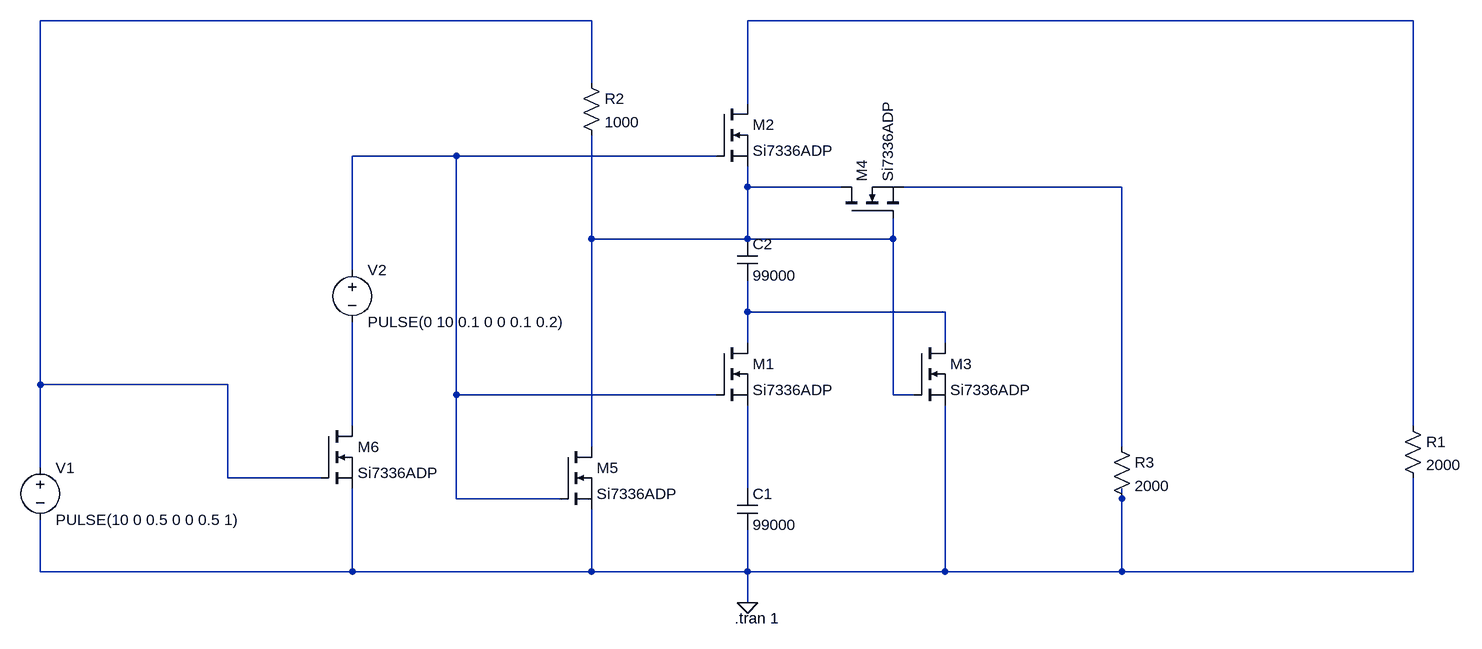
[diagram p0: schematic battery_cell_configuration_change.asc]
battery_cell_configuration_change.asc, the LTspice schematic file:
Version 4
SHEET 1 1140 680
WIRE -208 -576 -1056 -576
WIRE 1056 -576 32 -576
WIRE -208 -480 -208 -576
WIRE 32 -448 32 -576
WIRE -416 -368 -576 -368
WIRE -16 -368 -416 -368
WIRE 32 -320 32 -352
WIRE 176 -320 32 -320
WIRE 608 -320 272 -320
WIRE -208 -240 -208 -400
WIRE 32 -240 32 -320
WIRE 32 -240 -208 -240
WIRE 256 -240 256 -272
WIRE 256 -240 32 -240
WIRE -576 -192 -576 -368
WIRE 32 -128 32 -176
WIRE 336 -128 32 -128
WIRE 32 -80 32 -128
WIRE 336 -80 336 -128
WIRE -1056 -16 -1056 -576
WIRE -768 -16 -1056 -16
WIRE -416 0 -416 -368
WIRE -16 0 -416 0
WIRE 256 0 256 -240
WIRE 288 0 256 0
WIRE -576 48 -576 -112
WIRE 1056 48 1056 -576
WIRE -208 80 -208 -240
WIRE 608 80 608 -320
WIRE -1056 112 -1056 -16
WIRE -768 128 -768 -16
WIRE -624 128 -768 128
WIRE 32 144 32 16
WIRE -416 160 -416 0
WIRE -256 160 -416 160
WIRE 608 160 608 144
WIRE -1056 272 -1056 192
WIRE -576 272 -576 144
WIRE -576 272 -1056 272
WIRE -208 272 -208 176
WIRE -208 272 -576 272
WIRE 32 272 32 208
WIRE 32 272 -208 272
WIRE 336 272 336 16
WIRE 336 272 32 272
WIRE 608 272 608 160
WIRE 608 272 336 272
WIRE 1056 272 1056 128
WIRE 1056 272 608 272
WIRE 32 320 32 272
FLAG 32 320 0
SYMBOL cap 16 144 R0
SYMATTR InstName C1
SYMATTR Value 99000
SYMATTR SpiceLine Rser=100m,IC=2
SYMBOL cap 16 -240 R0
SYMATTR InstName C2
SYMATTR Value 99000
SYMATTR SpiceLine Rser=100m,IC=2
SYMBOL res 1040 32 R0
SYMATTR InstName R1
SYMATTR Value 2000
SYMBOL voltage -1056 96 R0
WINDOW 123 0 0 Left 0
WINDOW 39 0 0 Left 0
SYMATTR InstName V1
SYMATTR Value PULSE(10 0 0.5 0 0 0.5 1)
SYMBOL nmos -16 -80 R0
SYMATTR InstName M1
SYMATTR Value Si7336ADP
SYMBOL nmos -16 -448 R0
SYMATTR InstName M2
SYMATTR Value Si7336ADP
SYMBOL nmos 288 -80 R0
SYMATTR InstName M3
SYMATTR Value Si7336ADP
SYMBOL nmos 176 -272 R270
SYMATTR InstName M4
SYMATTR Value Si7336ADP
SYMBOL nmos -256 80 R0
SYMATTR InstName M5
SYMATTR Value Si7336ADP
SYMBOL res -224 -496 R0
SYMATTR InstName R2
SYMATTR Value 1000
SYMBOL voltage -576 -208 R0
WINDOW 123 0 0 Left 0
WINDOW 39 0 0 Left 0
SYMATTR InstName V2
SYMATTR Value PULSE(0 10 0.1 0 0 0.1 0.2)
SYMBOL res 592 64 R0
SYMATTR InstName R3
SYMATTR Value 2000
SYMBOL nmos -624 48 R0
SYMATTR InstName M6
SYMATTR Value Si7336ADP
TEXT 12 344 Left 2 !.tran 1

The netlist it stands for:
* battery_cell_configuration_change.asc
C1 N008 0 99000 Rser=100m,IC=2
C2 N004 N006 99000 Rser=100m,IC=2
R1 N002 0 2000
V1 N001 0 PULSE(10 0 0.5 0 0 0.5 1)
M1 N006 N003 N008 N008 Si7336ADP
M2 N002 N003 N004 N004 Si7336ADP
M3 N006 N004 0 0 Si7336ADP
M4 N004 N004 N005 N005 Si7336ADP
M5 N004 N003 0 0 Si7336ADP
R2 N001 N004 1000
V2 N003 N007 PULSE(0 10 0.1 0 0 0.1 0.2)
R3 N005 0 2000
M6 N007 N001 0 0 Si7336ADP
.model NMOS NMOS
.model PMOS PMOS
.lib standard.mos
.tran 1
.backanno
.end